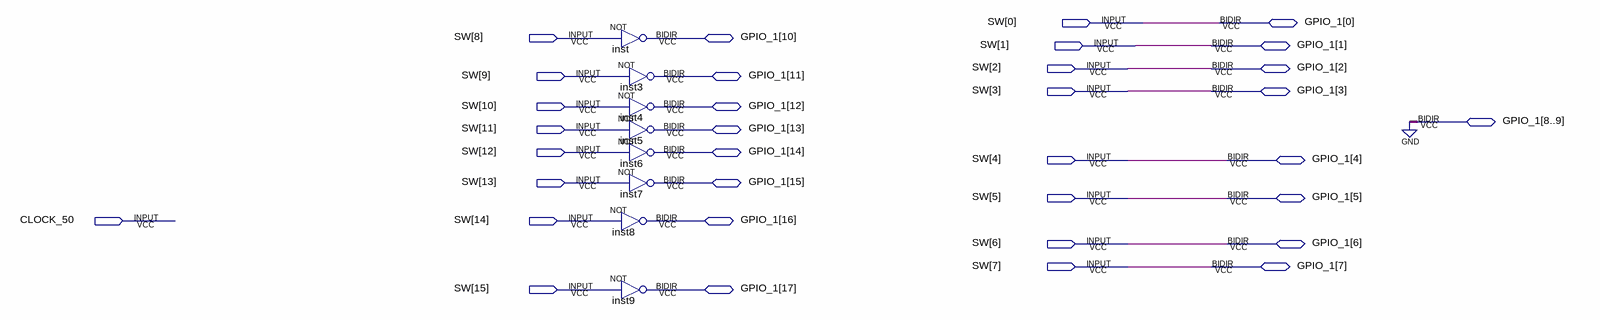
[diagram p0: schematic sheet]
// Quartus schematic TesteMatriz.bdf as structural Verilog: 8 symbols, 34 pins
module TesteMatriz (
  input  [15:0] SW,
  input  CLOCK_50,
  inout  [0:17] GPIO_1
);

  not inst (GPIO_1[10], SW[8]);
  not inst3 (GPIO_1[11], SW[9]);
  not inst4 (GPIO_1[12], SW[10]);
  not inst5 (GPIO_1[13], SW[11]);
  not inst6 (GPIO_1[14], SW[12]);
  not inst7 (GPIO_1[15], SW[13]);
  not inst8 (GPIO_1[16], SW[14]);
  not inst9 (GPIO_1[17], SW[15]);

  assign GPIO_1[0:7] = {SW[0], SW[1], SW[2], SW[3], SW[4], SW[5], SW[6], SW[7]};
  // also tied to GND on the sheet: GPIO_1[8:9]
endmodule
